# Altium schematic sheet hv_psu_v100_TESTLOAD.SchDoc
size A4; SheetNumber: 5; SheetTotal: 7
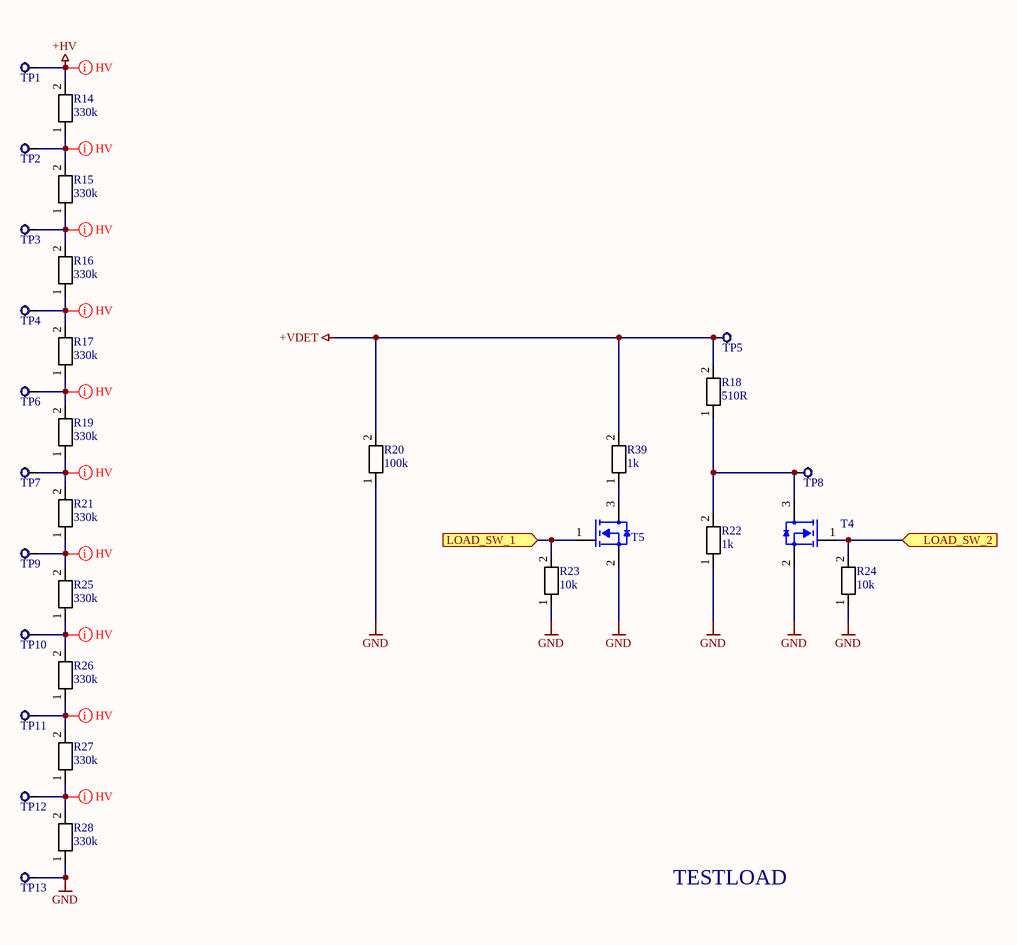
[diagram p0: hv_psu_v100_TESTLOAD.SchDoc]

## Parts
R14  330k  [1206]
R15  330k  [1206]
R16  330k  [1206]
R17  330k  [1206]
R18  510R  [1206]
R19  330k  [1206]
R20  100k  [1206]
R21  330k  [1206]
R22  1k  [1206]
R23  10k  [1206]
R24  10k  [1206]
R25  330k  [1206]
R26  330k  [1206]
R27  330k  [1206]
R28  330k  [1206]
R39  1k  [1206]
T4  MMBF170  [SOT23]  (value not drawn)
T5  MMBF170  [SOT23]  (value not drawn)
TP1  ?  [PAD_40]  (value not drawn)  (no BOM)
TP2  ?  [PAD_40]  (value not drawn)  (no BOM)
TP3  ?  [PAD_40]  (value not drawn)  (no BOM)
TP4  ?  [PAD_40]  (value not drawn)  (no BOM)
TP5  ?  [PAD_40]  (value not drawn)  (no BOM)
TP6  ?  [PAD_40]  (value not drawn)  (no BOM)
TP7  ?  [PAD_40]  (value not drawn)  (no BOM)
TP8  ?  [PAD_40]  (value not drawn)  (no BOM)
TP9  ?  [PAD_40]  (value not drawn)  (no BOM)
TP10  ?  [PAD_40]  (value not drawn)  (no BOM)
TP11  ?  [PAD_40]  (value not drawn)  (no BOM)
TP12  ?  [PAD_40]  (value not drawn)  (no BOM)
TP13  ?  [PAD_40]  (value not drawn)  (no BOM)

## Ports
LOAD_SW_1 (in), LOAD_SW_2 (in)

## Nets
+HV: R14.2 TP1.1
+VDET: R18.2 R20.2 R39.2 TP5.1
GND: R20.1 R22.1 R23.1 R24.1 R28.1 T4.2(Source) T5.2(Source) TP13.1
LOAD_SW_1: R23.2 T5.1(Gate) ; port LOAD_SW_1
LOAD_SW_2: R24.2 T4.1(Gate) ; port LOAD_SW_2
NetR14_1: R14.1 R15.2 TP2.1
NetR15_1: R15.1 R16.2 TP3.1
NetR16_1: R16.1 R17.2 TP4.1
NetR17_1: R17.1 R19.2 TP6.1
NetR18_1: R18.1 R22.2 T4.3(Drain) TP8.1
NetR19_1: R19.1 R21.2 TP7.1
NetR21_1: R21.1 R25.2 TP9.1
NetR25_1: R25.1 R26.2 TP10.1
NetR26_1: R26.1 R27.2 TP11.1
NetR27_1: R27.1 R28.2 TP12.1
NetR39_1: R39.1 T5.3(Drain)

## Layout directives
net class HV: +HV, NetR14_1, NetR15_1, NetR16_1, NetR17_1, NetR19_1, NetR21_1, NetR25_1, NetR26_1, NetR27_1

## Notes on the sheet
- TESTLOAD

## Library data of the parts
R14-R22 R25-R28 R39 = RESISTOR: Parameter 1: 10k
R23 R24 = RESISTOR: Parameter 1: 10k
T4 T5 = MMBF170: N MOSFET
TP1-TP13 = TESTPOINT